# Altium project MB1430.PrjPcb (part 2 of 2)
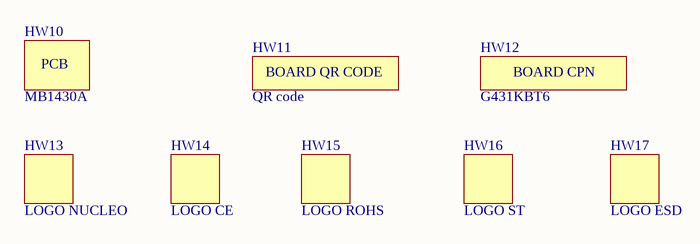
[diagram p7: Mechanical.SchDoc]

## Nets that join several sheets
3V3: Arduino_extension_connectors (CN3.14 R16.2), Power (JP1.1 SB15.2), STLink_V3E_Module (R3.2)
3V3_STLK: Power (39 pins), STLink_V3E_Module (6 pins)
5V: Arduino_extension_connectors (CN3.4), Power (7 pins), STLink_V3E_Module (R1.2)
5V_USB_CHGR: Power (D1.1), STLink_V3E_Module (6 pins)
5V_USB_STLK: Power (D4.1), STLink_V3E_Module (C43.2 U7.1)
AVDD: Arduino_extension_connectors (CN3.13), STM32G4_microcontroller (5 pins)
GND: Arduino_extension_connectors (CN3.2 CN4.4 Q1.2 R24.1), Power (76 pins), STM32G4_microcontroller (14 pins), STLink_V3E_Module (26 pins)
VDD: Power (JP1.2), STM32G4_microcontroller (7 pins)
VIN: Arduino_extension_connectors (CN3.1), Power (C41.2 U8.3)
ARD_A2: Arduino_extension_connectors (CN3.10), STM32G4_microcontroller (SB14.1)
PA0: Arduino_extension_connectors (CN3.12), STM32G4_microcontroller (U1.5)
PA1: Arduino_extension_connectors (CN3.11), STM32G4_microcontroller (U1.6)
PA2: Arduino_extension_connectors (CN3.5), STM32G4_microcontroller (SB1.2 U1.7)
PA4: Arduino_extension_connectors (CN3.9), STM32G4_microcontroller (U1.9)
PA5: Arduino_extension_connectors (CN3.8 SB2.1), STM32G4_microcontroller (U1.10)
PA6: Arduino_extension_connectors (CN3.7 SB3.1), STM32G4_microcontroller (U1.11)
PA7: Arduino_extension_connectors (CN3.6), STM32G4_microcontroller (U1.12)
PA8: Arduino_extension_connectors (CN4.12), STM32G4_microcontroller (U1.18)
PA9: Arduino_extension_connectors (CN4.1), STM32G4_microcontroller (U1.19)
PA10: Arduino_extension_connectors (CN4.2), STM32G4_microcontroller (U1.20)
PA11: Arduino_extension_connectors (CN4.13), STM32G4_microcontroller (U1.21)
PA12: Arduino_extension_connectors (CN4.5), STM32G4_microcontroller (U1.22)
PA15: Arduino_extension_connectors (CN4.8 SB3.2), STM32G4_microcontroller (U1.25)
PB0: Arduino_extension_connectors (CN4.6), STM32G4_microcontroller (U1.13)
PB3: Arduino_extension_connectors (CN3.15 SB6.1), STM32G4_microcontroller (SB4.1 U1.26)
PB4: Arduino_extension_connectors (CN4.15), STM32G4_microcontroller (U1.27)
PB5: Arduino_extension_connectors (CN4.14), STM32G4_microcontroller (U1.28)
PB6: Arduino_extension_connectors (CN4.9), STM32G4_microcontroller (U1.29)
PB7: Arduino_extension_connectors (CN4.7 SB2.2), STM32G4_microcontroller (U1.30)
PB8: Arduino_extension_connectors (SB7.1), STM32G4_microcontroller (R15.2 U1.31)
PF0: Arduino_extension_connectors (CN4.10), STM32G4_microcontroller (SB8.1)
PF1: Arduino_extension_connectors (CN4.11), STM32G4_microcontroller (SB11.1)
STLK_MCO: STM32G4_microcontroller (SB13.1), STLink_V3E_Module (C14.2 R11.2)
T_NRST: Arduino_extension_connectors (CN3.3 CN4.3), STM32G4_microcontroller (B1.1 C20.2 U1.4 U2.1), STLink_V3E_Module (R4.1)
T_SWCLK: STM32G4_microcontroller (U1.24), STLink_V3E_Module (R13.1)
T_SWDIO: STM32G4_microcontroller (U1.23), STLink_V3E_Module (R14.1)
T_SWO: STM32G4_microcontroller (SB4.2), STLink_V3E_Module (R10.1)
T_VCP_RX: STM32G4_microcontroller (SB12.1), STLink_V3E_Module (R21.2)
T_VCP_TX: STM32G4_microcontroller (SB1.1), STLink_V3E_Module (R9.1)

## Assembly variants
G431KBT6: not fitted CN2 SB6 SB8 SB9 SB10 SB11 SB13 SB14
G431KBU6: not fitted CN2 SB6 SB8 SB9 SB10 SB11 SB13 SB14